# Altium schematic sheet Second_common.SchDoc
size 209 x 297 mm; Organization: Altium Limited; Address1: L3, 12a Rodborough Rd; Address2: Frenchs Forest; Address3: NSW; Address4: Australia 2086; Scale: 1:1; Обозначение документа: МГТУ.143014.003 Э1; Номер листа: 1; Общее количество листов: 1; Разраб.: Волков М.А.; Пров.: Рафиков А.Г.; Утв.: Рафиков А.Г.; Масштаб: 1:1; Наименование организации: МГТУ им. Н.Э. Баумана ИУ8; Перв. применение: МГТУ.143014.003; Наименование изделия 1: Взаимодействие LoRaSTM32; Наименование изделия 2: Схема электрическая; Наименование изделия 3: структурная; Нач. отд.: Нач. отд.
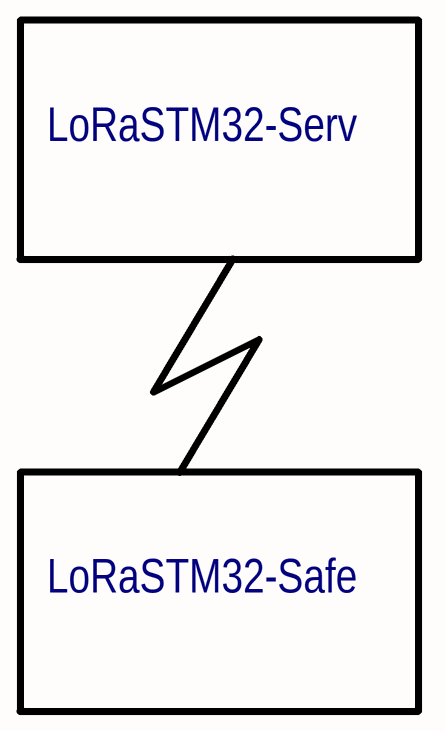
[diagram p0: Second_common.SchDoc]

## Notes on the sheet
- LoRaSTM32-Serv
- LoRaSTM32-Safe
- Перв. примен.
- Справ. №
- Подп. и дата
- Инв. № дубл.
- Взам. инв. №
- Разраб.
- Изм.
- Лист
- № докум.
- Подп.
- Дата
- Лит.
- Масса
- Масштаб
- Пров.
- Т.контр.
- Листов
- Инв. № подл.
- Утв.
- Н.контр.
- Копировал
- Формат А4